# Altium schematic sheet power.SchDoc
size A4
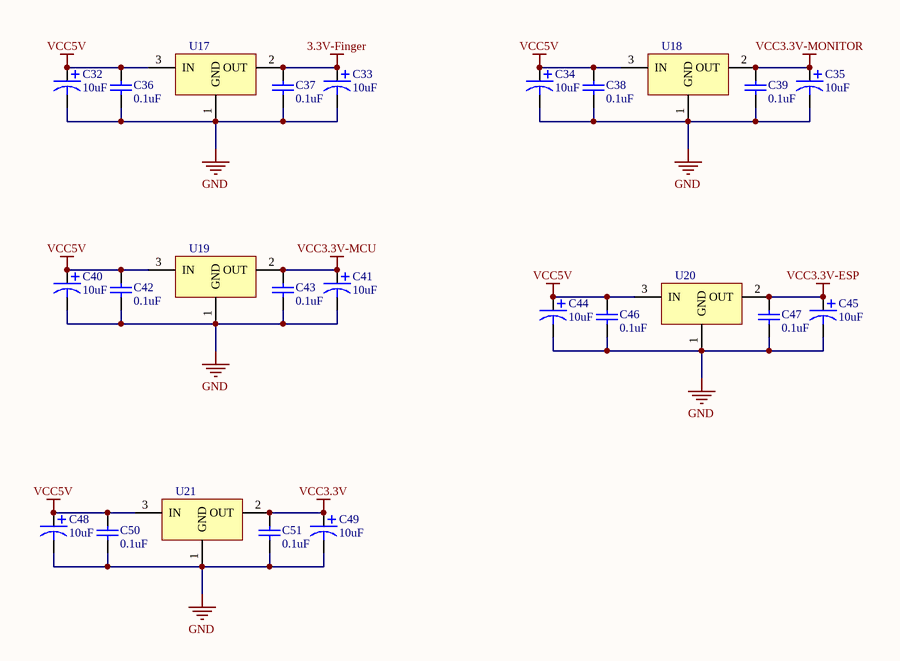
[diagram p0: power.SchDoc]

## Parts
C32  10uF  [1206_C]
C33  10uF  [1206_C]
C34  10uF  [1206_C]
C35  10uF  [1206_C]
C36  0.1uF  [0603_C]
C37  0.1uF  [0603_C]
C38  0.1uF  [0603_C]
C39  0.1uF  [0603_C]
C40  10uF  [1206_C]
C41  10uF  [1206_C]
C42  0.1uF  [0603_C]
C43  0.1uF  [0603_C]
C44  10uF  [1206_C]
C45  10uF  [1206_C]
C46  0.1uF  [0603_C]
C47  0.1uF  [0603_C]
C48  10uF  [1206_C]
C49  10uF  [1206_C]
C50  0.1uF  [0603_C]
C51  0.1uF  [0603_C]
U17  LM1117  [SOT-223]  (value not drawn)
U18  LM1117  [SOT-223]  (value not drawn)
U19  LM1117  [SOT-223]  (value not drawn)
U20  LM1117  [SOT-223]  (value not drawn)
U21  LM1117  [SOT-223]  (value not drawn)

## Nets
3.3V-Finger: C33.1 C37.1 U17.2(OUT)
GND: C32.2 C33.2 C34.2 C35.2 C36.2 C37.2 C38.2 C39.2 C40.2 C41.2 C42.2 C43.2 C44.2 C45.2 C46.2 C47.2 C48.2 C49.2 C50.2 C51.2 U17.1(GND) U18.1(GND) U19.1(GND) U20.1(GND) U21.1(GND)
VCC3.3V: C49.1 C51.1 U21.2(OUT)
VCC3.3V-ESP: C45.1 C47.1 U20.2(OUT)
VCC3.3V-MCU: C41.1 C43.1 U19.2(OUT)
VCC3.3V-MONITOR: C35.1 C39.1 U18.2(OUT)
VCC5V: C32.1 C34.1 C36.1 C38.1 C40.1 C42.1 C44.1 C46.1 C48.1 C50.1 U17.3(IN) U18.3(IN) U19.3(IN) U20.3(IN) U21.3(IN)

## Library data of the parts
C32-C35 C40 C41 C44 C45 C48 C49 = CAPACITOR: 贴片电容，1206
C36-C39 C42 C43 C46 C47 C50 C51 = Cap: 贴片电容，0603